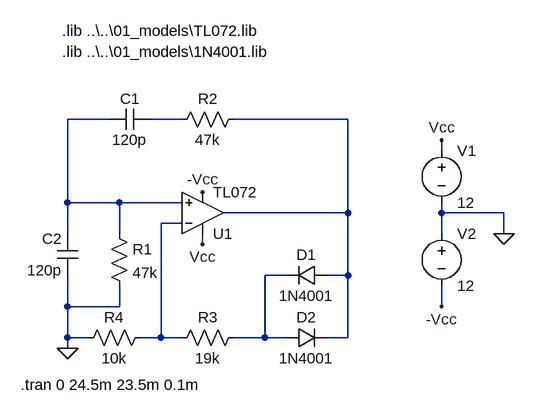
[diagram p0: schematic wien_bridge.asc]
wien_bridge.asc, the LTspice schematic file:
Version 4
SHEET 1 980 680
WIRE 32 0 -32 0
WIRE 144 0 96 0
WIRE 400 0 224 0
WIRE 544 48 544 32
WIRE -32 128 -32 0
WIRE 48 128 -32 128
WIRE 144 128 48 128
WIRE 400 144 400 0
WIRE 400 144 208 144
WIRE 544 144 544 128
WIRE 640 144 544 144
WIRE 144 160 112 160
WIRE -32 176 -32 128
WIRE 48 176 48 128
WIRE 544 176 544 144
WIRE 640 176 640 144
WIRE 176 192 176 176
WIRE 304 240 272 240
WIRE 400 240 400 144
WIRE 400 240 368 240
WIRE -32 288 -32 240
WIRE 48 288 48 256
WIRE 48 288 -32 288
WIRE 544 288 544 256
WIRE -32 336 -32 288
WIRE 0 336 -32 336
WIRE 112 336 112 160
WIRE 112 336 80 336
WIRE 144 336 112 336
WIRE 272 336 272 240
WIRE 272 336 224 336
WIRE 304 336 272 336
WIRE 400 336 400 240
WIRE 400 336 368 336
WIRE -32 352 -32 336
FLAG 640 176 0
FLAG 544 32 Vcc
FLAG 544 288 -Vcc
FLAG 176 112 -Vcc
FLAG 176 192 Vcc
FLAG -32 352 0
SYMBOL cap 96 -16 R90
WINDOW 0 0 32 VBottom 2
WINDOW 3 32 32 VTop 2
SYMATTR InstName C1
SYMATTR Value 120p
SYMBOL cap -16 240 R180
WINDOW 0 24 56 Left 2
WINDOW 3 24 8 Left 2
SYMATTR InstName C2
SYMATTR Value 120p
SYMBOL res 32 160 R0
SYMATTR InstName R1
SYMATTR Value 47k
SYMBOL res 240 -16 R90
WINDOW 0 0 56 VBottom 2
WINDOW 3 32 56 VTop 2
SYMATTR InstName R2
SYMATTR Value 47k
SYMBOL res 240 320 R90
WINDOW 0 0 56 VBottom 2
WINDOW 3 32 56 VTop 2
SYMATTR InstName R3
SYMATTR Value 19k
SYMBOL res 96 320 R90
WINDOW 0 0 56 VBottom 2
WINDOW 3 32 56 VTop 2
SYMATTR InstName R4
SYMATTR Value 10k
SYMBOL diode 368 224 R90
WINDOW 0 0 32 VBottom 2
WINDOW 3 32 32 VTop 2
SYMATTR InstName D1
SYMATTR Value 1N4001
SYMBOL diode 304 352 R270
WINDOW 0 32 32 VTop 2
WINDOW 3 0 32 VBottom 2
SYMATTR InstName D2
SYMATTR Value 1N4001
SYMBOL voltage 544 32 R0
WINDOW 123 0 0 Left 2
WINDOW 39 0 0 Left 2
SYMATTR InstName V1
SYMATTR Value 12
SYMBOL voltage 544 160 R0
WINDOW 123 0 0 Left 2
WINDOW 39 0 0 Left 2
SYMATTR InstName V2
SYMATTR Value 12
SYMBOL Opamps\\opamp2 176 208 M180
SYMATTR InstName U1
SYMATTR Value TL072
TEXT -40 -136 Left 2 !.lib ..\\..\\01_models\\TL072.lib
TEXT -40 -104 Left 2 !.lib ..\\..\\01_models\\1N4001.lib
TEXT -104 408 Left 2 !.tran 0 24.5m 23.5m 0.1m

The netlist it stands for:
* wien_bridge.asc
C1 N002 N001 120p
C2 0 N001 120p
R1 N001 0 47k
R2 N003 N002 47k
R3 N005 N004 19k
R4 N004 0 10k
D1 N003 N005 1N4001
D2 N005 N003 1N4001
V1 Vcc 0 12
V2 0 -Vcc 12
XU1 N001 N004 Vcc -Vcc N003 TL072  ; pins In+ In- V+ V- OUT
.model D D
.lib standard.dio
.lib ..\..\01_models\TL072.lib
.lib ..\..\01_models\1N4001.lib
.tran 0 24.5m 23.5m 0.1m
.backanno
.end